# Altium schematic sheet Peripherals.SchDoc
size A4; SheetNumber: 6; SheetTotal: 7
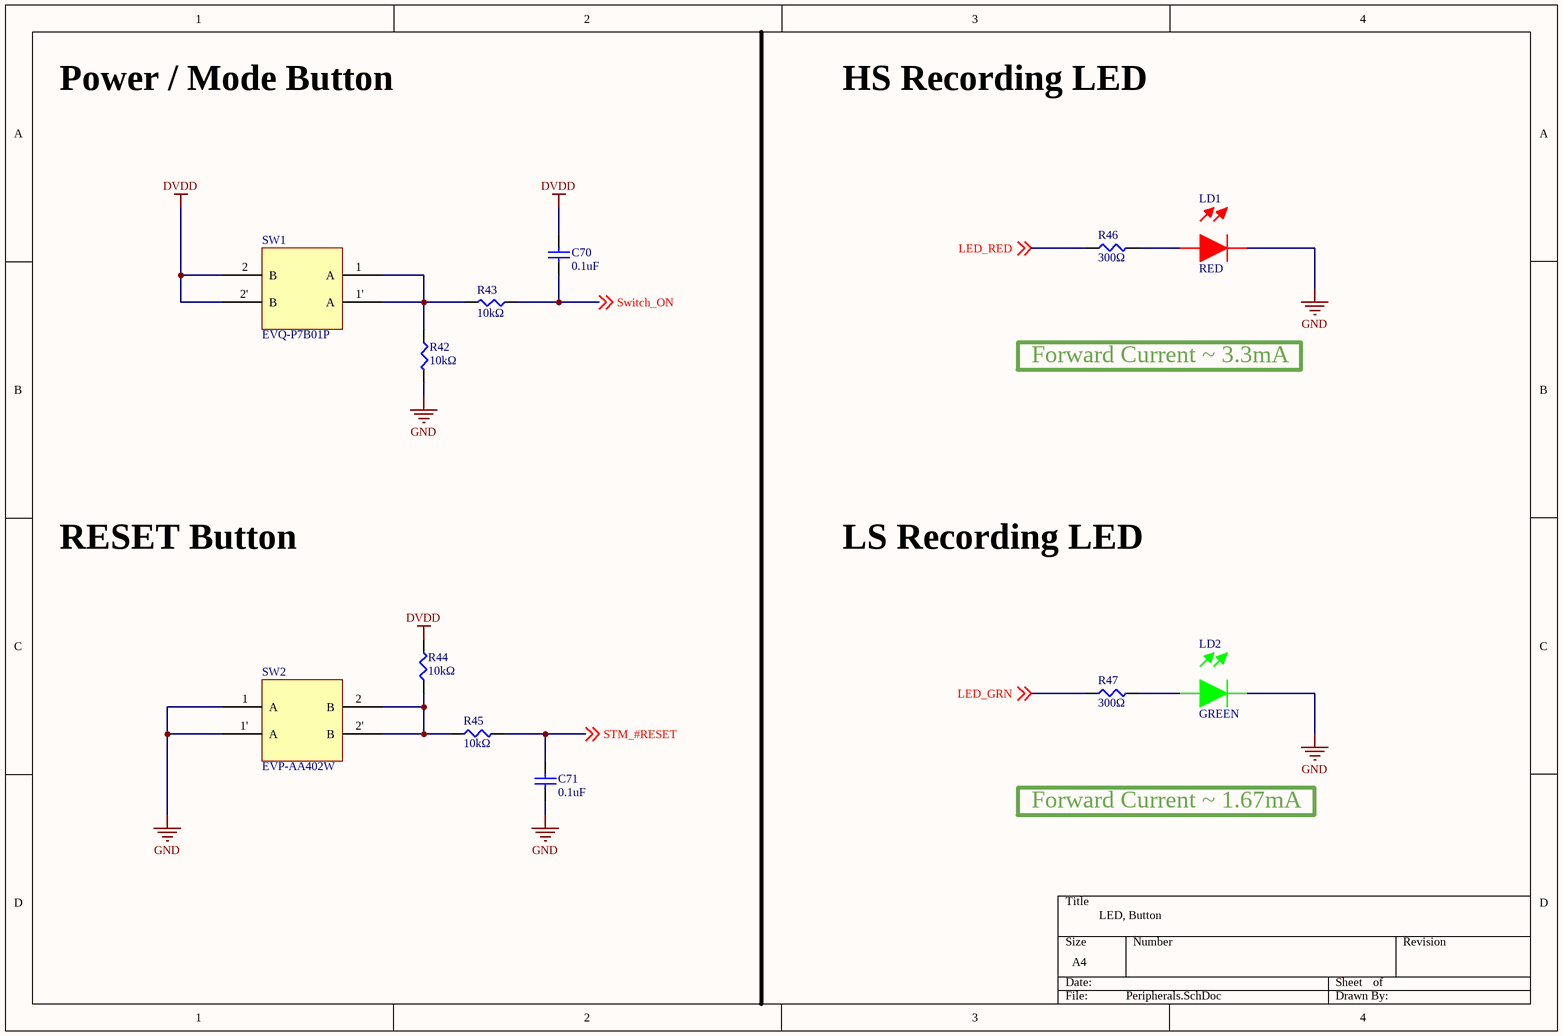
[diagram p0: Peripherals.SchDoc]

## Parts
C70  0.1uF  [0402]
C71  0.1uF  [0402]
LD1  RED  [RED]
LD2  GREEN  [GREEN]
R42  10kΩ  [0402]
R43  10kΩ  [0402]
R44  10kΩ  [0402]
R45  10kΩ  [0402]
R46  300Ω  [0402]
R47  300Ω  [0402]
SW1  EVQ-P7B01P  [2.2N]
SW2  EVP-AA402W  [2.4N]

## Nets
DVDD: C70.1 R44.2 SW1.2(B) SW1.2'(B)
GND: C71.1 LD1.C LD2.C R42.2 SW2.1(A) SW2.1'(A)
LED_GRN: R47.1 ; off-sheet LED_GRN
LED_RED: R46.1 ; off-sheet LED_RED
STM_#RESET: C71.2 R45.2 ; off-sheet STM_#RESET
Switch_ON: C70.2 R43.1 ; off-sheet Switch_ON
NetLD1_A: LD1.A R46.2
NetLD2_A: LD2.A R47.2
NetR42_1: R42.1 R43.2 SW1.1(A) SW1.1'(A)
NetR44_1: R44.1 R45.1 SW2.2(B) SW2.2'(B)

## Notes on the sheet
- Power / Mode Button
- HS Recording LED
- Forward Current ~ 3.3mA
- RESET Button
- LS Recording LED
- Forward Current ~ 1.67mA
- LED, Button

## Library data of the parts
C70 C71 = 0402: MLCC-0402
R42-R47 = 0402: Resistor_SMD_0402; AuthorBy: yjlab
SW1 = EVQ-P7B01P: Light Touch Switch, Right Angle, Operating Force 2.2 (N)
SW2 = EVP-AA402W: Lite Touch Switch, Vertical, Operating Force 2.4(N)